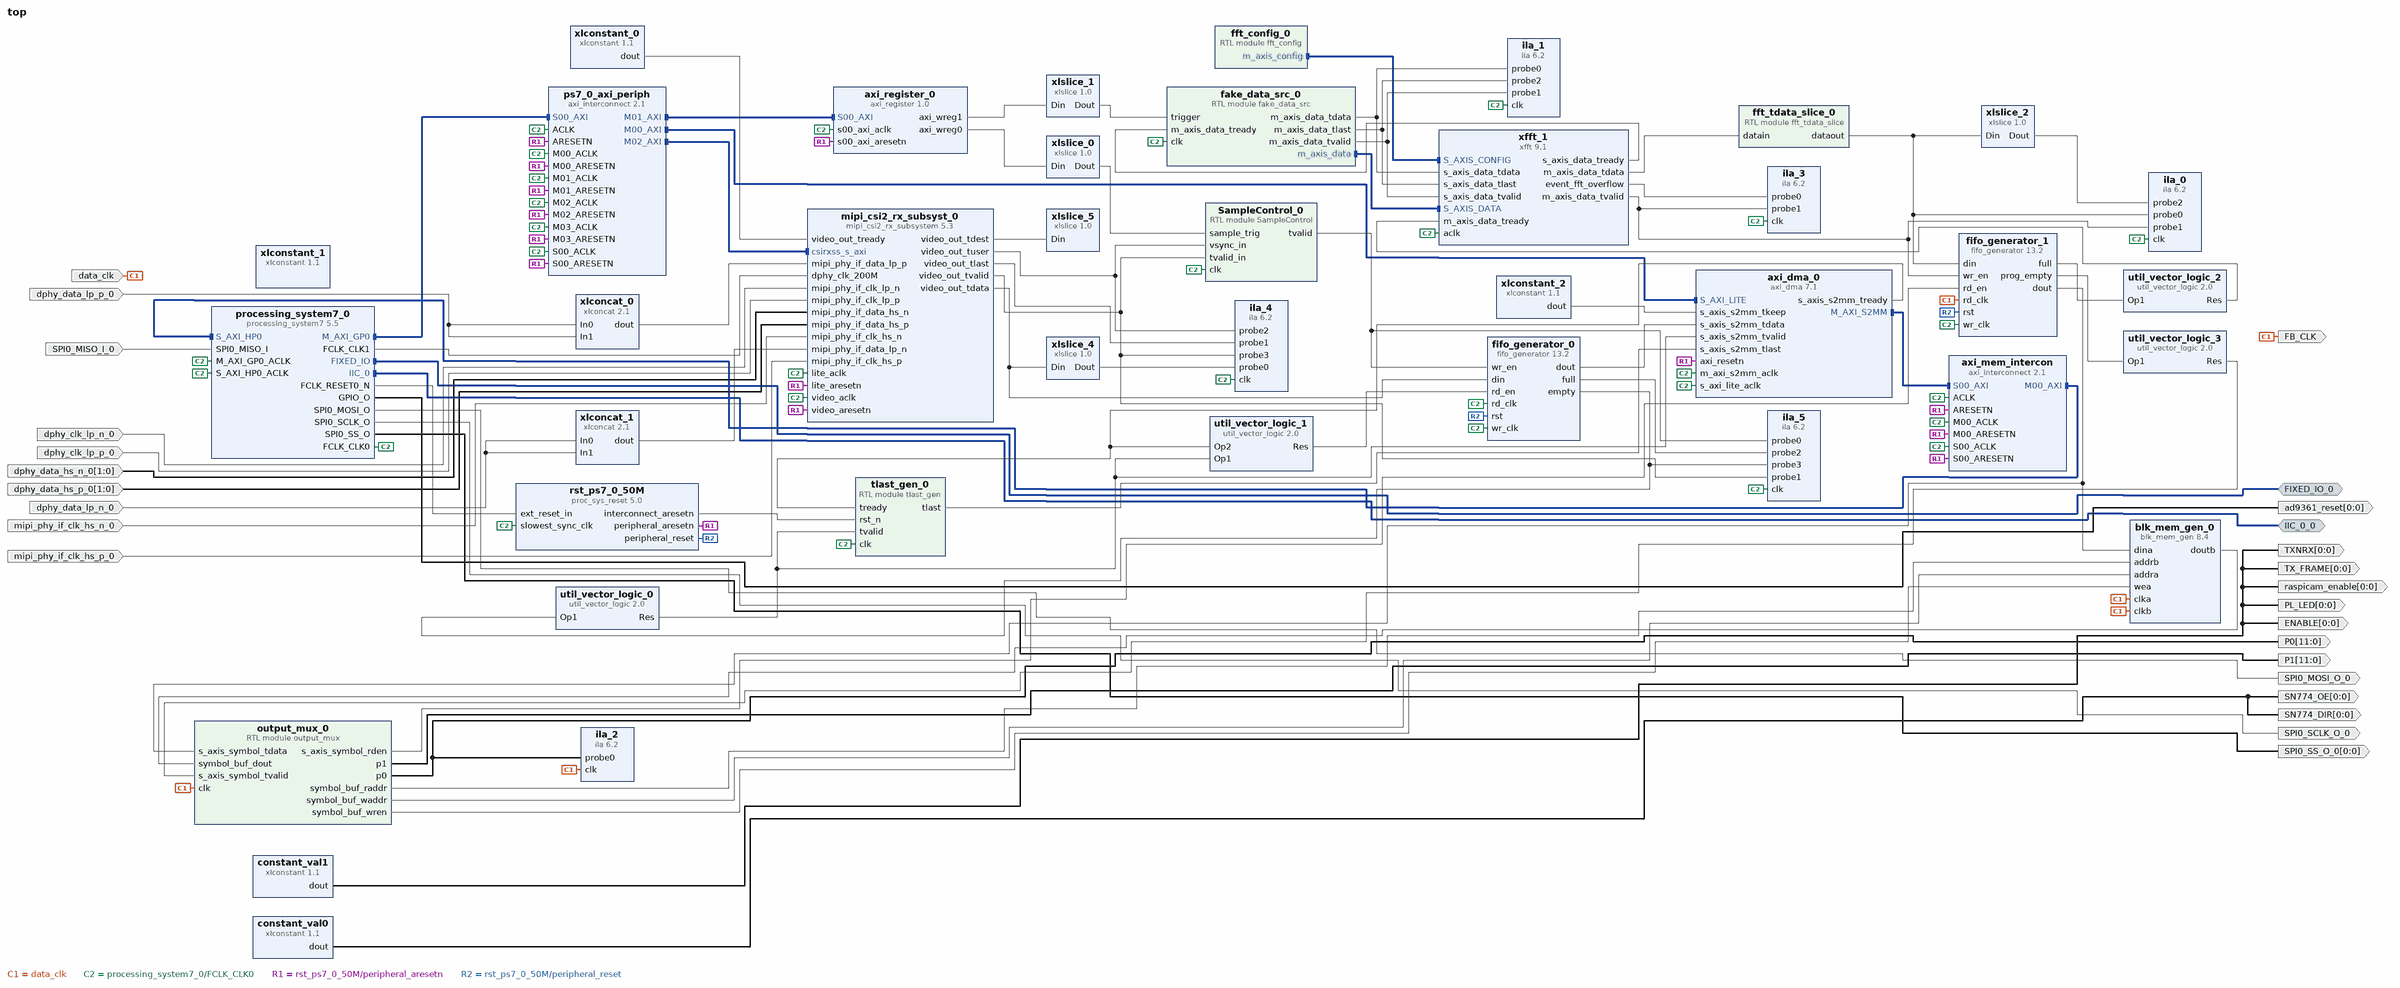
[diagram p0: block diagram of the top level]
# Vivado block design top, xc7z010clg400-2, Vivado 2023.1
create_bd_design top

create_bd_intf_port -mode Master -vlnv xilinx.com:display_processing_system7:fixedio_rtl:1.0 FIXED_IO_0
create_bd_intf_port -mode Master -vlnv xilinx.com:interface:iic_rtl:1.0 IIC_0_0
create_bd_port -dir O -from 0 -to 0 ENABLE
create_bd_port -dir O -type clk FB_CLK
create_bd_port -dir O -from 11 -to 0 -type data P0
create_bd_port -dir O -from 11 -to 0 -type data P1
create_bd_port -dir I SPI0_MISO_I_0
create_bd_port -dir O SPI0_MOSI_O_0
create_bd_port -dir O SPI0_SCLK_O_0
create_bd_port -dir O -from 0 -to 0 SPI0_SS_O_0
create_bd_port -dir O -from 0 -to 0 TXNRX
create_bd_port -dir O -from 0 -to 0 -type data TX_FRAME
create_bd_port -dir O -from 0 -to 0 ad9361_reset
create_bd_port -dir I data_clk
create_bd_port -dir I dphy_clk_lp_p_0
create_bd_port -dir I dphy_clk_lp_n_0
create_bd_port -dir I -from 1 -to 0 dphy_data_hs_p_0
create_bd_port -dir I -from 1 -to 0 dphy_data_hs_n_0
create_bd_port -dir I dphy_data_lp_p_0
create_bd_port -dir I dphy_data_lp_n_0
create_bd_port -dir O -from 0 -to 0 PL_LED
create_bd_port -dir O -from 0 -to 0 raspicam_enable
create_bd_port -dir O -from 0 -to 0 SN774_OE
create_bd_port -dir O -from 0 -to 0 SN774_DIR
create_bd_port -dir I mipi_phy_if_clk_hs_n_0
create_bd_port -dir I mipi_phy_if_clk_hs_p_0

create_bd_cell -type ip -vlnv xilinx.com:ip:axi_dma:7.1 axi_dma_0
set_property -dict [list \
  CONFIG.c_include_mm2s 0 \
  CONFIG.c_include_s2mm 1 \
  CONFIG.c_include_s2mm_dre 1 \
  CONFIG.c_include_sg 0 \
  CONFIG.c_s2mm_burst_size 64 \
  CONFIG.c_sg_length_width 26 \
] [get_bd_cells axi_dma_0]
create_bd_cell -type ip -vlnv xilinx.com:ip:axi_interconnect:2.1 axi_mem_intercon
set_property -dict {CONFIG.NUM_MI 1} [get_bd_cells axi_mem_intercon]
create_bd_cell -type ip -vlnv xilinx.com:user:axi_register:1.0 axi_register_0
create_bd_cell -type ip -vlnv xilinx.com:ip:blk_mem_gen:8.4 blk_mem_gen_0
set_property -dict [list \
  CONFIG.Assume_Synchronous_Clk true \
  CONFIG.Enable_32bit_Address false \
  CONFIG.Enable_A Always_Enabled \
  CONFIG.Enable_B Always_Enabled \
  CONFIG.Fill_Remaining_Memory_Locations true \
  CONFIG.Memory_Type Simple_Dual_Port_RAM \
  CONFIG.Operating_Mode_A NO_CHANGE \
  CONFIG.Port_B_Clock 100 \
  CONFIG.Port_B_Enable_Rate 100 \
  CONFIG.Read_Width_B 24 \
  CONFIG.Register_PortB_Output_of_Memory_Primitives false \
  CONFIG.Use_Byte_Write_Enable false \
  CONFIG.Write_Depth_A 2048 \
  CONFIG.Write_Width_A 24 \
  CONFIG.Write_Width_B 24 \
  CONFIG.use_bram_block Stand_Alone \
] [get_bd_cells blk_mem_gen_0]
create_bd_cell -type module -reference fake_data_src fake_data_src_0
create_bd_cell -type module -reference fft_config fft_config_0
create_bd_cell -type module -reference fft_tdata_slice fft_tdata_slice_0
create_bd_cell -type ip -vlnv xilinx.com:ip:fifo_generator:13.2 fifo_generator_0
set_property -dict [list \
  CONFIG.Fifo_Implementation Independent_Clocks_Builtin_FIFO \
  CONFIG.Input_Data_Width 32 \
  CONFIG.Input_Depth 1024 \
  CONFIG.Performance_Options First_Word_Fall_Through \
  CONFIG.Read_Clock_Frequency 100 \
  CONFIG.Write_Clock_Frequency 61 \
] [get_bd_cells fifo_generator_0]
create_bd_cell -type ip -vlnv xilinx.com:ip:fifo_generator:13.2 fifo_generator_1
set_property -dict [list \
  CONFIG.Empty_Threshold_Assert_Value 128 \
  CONFIG.Fifo_Implementation Independent_Clocks_Builtin_FIFO \
  CONFIG.INTERFACE_TYPE Native \
  CONFIG.Input_Data_Width 24 \
  CONFIG.Input_Depth 8192 \
  CONFIG.Performance_Options First_Word_Fall_Through \
  CONFIG.Programmable_Empty_Type Single_Programmable_Empty_Threshold_Constant \
  CONFIG.Read_Clock_Frequency 61 \
  CONFIG.Write_Clock_Frequency 150 \
  CONFIG.axis_type FIFO \
] [get_bd_cells fifo_generator_1]
create_bd_cell -type ip -vlnv xilinx.com:ip:ila:6.2 ila_0
set_property -dict [list \
  CONFIG.C_DATA_DEPTH 4096 \
  CONFIG.C_ENABLE_ILA_AXI_MON false \
  CONFIG.C_MONITOR_TYPE Native \
  CONFIG.C_NUM_OF_PROBES 3 \
  CONFIG.C_PROBE0_WIDTH 12 \
  CONFIG.C_PROBE2_WIDTH 12 \
] [get_bd_cells ila_0]
create_bd_cell -type ip -vlnv xilinx.com:ip:ila:6.2 ila_1
set_property -dict [list \
  CONFIG.C_DATA_DEPTH 4096 \
  CONFIG.C_ENABLE_ILA_AXI_MON false \
  CONFIG.C_MONITOR_TYPE Native \
  CONFIG.C_NUM_OF_PROBES 3 \
  CONFIG.C_PROBE0_WIDTH 12 \
] [get_bd_cells ila_1]
create_bd_cell -type ip -vlnv xilinx.com:ip:ila:6.2 ila_2
set_property -dict [list \
  CONFIG.C_DATA_DEPTH 8192 \
  CONFIG.C_ENABLE_ILA_AXI_MON false \
  CONFIG.C_MONITOR_TYPE Native \
  CONFIG.C_NUM_OF_PROBES 1 \
  CONFIG.C_PROBE0_WIDTH 12 \
] [get_bd_cells ila_2]
create_bd_cell -type ip -vlnv xilinx.com:ip:ila:6.2 ila_3
set_property -dict {CONFIG.C_ENABLE_ILA_AXI_MON false CONFIG.C_MONITOR_TYPE Native CONFIG.C_NUM_OF_PROBES 2} [get_bd_cells ila_3]
create_bd_cell -type ip -vlnv xilinx.com:ip:ila:6.2 ila_4
set_property -dict [list \
  CONFIG.C_DATA_DEPTH 8192 \
  CONFIG.C_MONITOR_TYPE Native \
  CONFIG.C_NUM_OF_PROBES 4 \
  CONFIG.C_PROBE0_WIDTH 10 \
  CONFIG.C_PROBE1_WIDTH 1 \
  CONFIG.C_PROBE2_WIDTH 1 \
  CONFIG.C_PROBE4_WIDTH 1 \
  CONFIG.C_SLOT_0_AXI_PROTOCOL AXI4S \
] [get_bd_cells ila_4]
create_bd_cell -type ip -vlnv xilinx.com:ip:mipi_csi2_rx_subsystem:5.3 mipi_csi2_rx_subsyst_0
set_property -dict [list \
  CONFIG.AXIS_TDATA_WIDTH 32 \
  CONFIG.AXIS_TUSER_WIDTH 1 \
  CONFIG.CMN_INC_VFB false \
  CONFIG.CMN_NUM_LANES 2 \
  CONFIG.CMN_PXL_FORMAT RAW10 \
  CONFIG.CSI_BUF_DEPTH 2048 \
  CONFIG.C_CSI_EN_ACTIVELANES false \
  CONFIG.C_CSI_FILTER_USERDATATYPE true \
  CONFIG.C_DPHY_LANES 2 \
  CONFIG.C_EN_7S_LINERATE_CHECK true \
  CONFIG.C_EN_TIMEOUT_REGS false \
  CONFIG.C_HS_SETTLE_NS 146 \
  CONFIG.DPY_EN_REG_IF true \
  CONFIG.DPY_LINE_RATE 900 \
] [get_bd_cells mipi_csi2_rx_subsyst_0]
create_bd_cell -type ip -vlnv xilinx.com:ip:processing_system7:5.5 processing_system7_0
set_property -dict [list \
  CONFIG.PCW_APU_CLK_RATIO_ENABLE 4:2:1 \
  CONFIG.PCW_APU_PERIPHERAL_FREQMHZ 200 \
  CONFIG.PCW_CPU_CPU_6X4X_MAX_RANGE 600 \
  CONFIG.PCW_CPU_PERIPHERAL_CLKSRC {DDR PLL} \
  CONFIG.PCW_CRYSTAL_PERIPHERAL_FREQMHZ 33.33333 \
  CONFIG.PCW_ENET0_PERIPHERAL_ENABLE 0 \
  CONFIG.PCW_EN_CLK1_PORT 1 \
  CONFIG.PCW_EN_CLK2_PORT 1 \
  CONFIG.PCW_FCLK_CLK2_BUF TRUE \
  CONFIG.PCW_FPGA0_PERIPHERAL_FREQMHZ 80 \
  CONFIG.PCW_FPGA1_PERIPHERAL_FREQMHZ 200 \
  CONFIG.PCW_FPGA2_PERIPHERAL_FREQMHZ 150 \
  CONFIG.PCW_FPGA_FCLK1_ENABLE 1 \
  CONFIG.PCW_FPGA_FCLK2_ENABLE 1 \
  CONFIG.PCW_GPIO_EMIO_GPIO_ENABLE 1 \
  CONFIG.PCW_GPIO_EMIO_GPIO_IO 1 \
  CONFIG.PCW_GPIO_EMIO_GPIO_WIDTH 1 \
  CONFIG.PCW_GPIO_MIO_GPIO_ENABLE 1 \
  CONFIG.PCW_GPIO_MIO_GPIO_IO MIO \
  CONFIG.PCW_I2C0_I2C0_IO EMIO \
  CONFIG.PCW_I2C0_PERIPHERAL_ENABLE 1 \
  CONFIG.PCW_I2C_PERIPHERAL_FREQMHZ 49.999996 \
  CONFIG.PCW_I2C_RESET_ENABLE 1 \
  CONFIG.PCW_I2C_RESET_SELECT {Share reset pin} \
  CONFIG.PCW_PERIPHERAL_BOARD_PRESET None \
  CONFIG.PCW_PRESET_BANK1_VOLTAGE {LVCMOS 3.3V} \
  CONFIG.PCW_QSPI_PERIPHERAL_ENABLE 0 \
  CONFIG.PCW_SD0_GRP_CD_ENABLE 0 \
  CONFIG.PCW_SD0_GRP_WP_ENABLE 0 \
  CONFIG.PCW_SD0_PERIPHERAL_ENABLE 1 \
  CONFIG.PCW_SD0_SD0_IO {MIO 40 .. 45} \
  CONFIG.PCW_SDIO_PERIPHERAL_FREQMHZ 50 \
  CONFIG.PCW_SPI0_PERIPHERAL_ENABLE 1 \
  CONFIG.PCW_SPI0_SPI0_IO EMIO \
  CONFIG.PCW_SPI_PERIPHERAL_FREQMHZ 100 \
  CONFIG.PCW_UART1_BAUD_RATE 921600 \
  CONFIG.PCW_UART1_PERIPHERAL_ENABLE 1 \
  CONFIG.PCW_UART1_UART1_IO {MIO 36 .. 37} \
  CONFIG.PCW_UART_PERIPHERAL_FREQMHZ 100 \
  CONFIG.PCW_UIPARAM_DDR_BUS_WIDTH {16 Bit} \
  CONFIG.PCW_UIPARAM_DDR_FREQ_MHZ 400 \
  CONFIG.PCW_UIPARAM_DDR_MEMORY_TYPE {DDR 3 (Low Voltage)} \
  CONFIG.PCW_UIPARAM_DDR_PARTNO {MT41K256M16 RE-125} \
  CONFIG.PCW_UIPARAM_GENERATE_SUMMARY NONE \
  CONFIG.PCW_USB0_PERIPHERAL_ENABLE 0 \
  CONFIG.PCW_USB_RESET_ENABLE 1 \
  CONFIG.PCW_USE_AXI_NONSECURE 1 \
  CONFIG.PCW_USE_S_AXI_HP0 1 \
] [get_bd_cells processing_system7_0]
# 490 more settings of processing_system7_0 are not shown: defaults, MIO pin electricals, DDR timing, and values the tool derives
create_bd_cell -type ip -vlnv xilinx.com:ip:axi_interconnect:2.1 ps7_0_axi_periph
set_property -dict {CONFIG.NUM_MI 4} [get_bd_cells ps7_0_axi_periph]
create_bd_cell -type ip -vlnv xilinx.com:ip:proc_sys_reset:5.0 rst_ps7_0_50M
create_bd_cell -type ip -vlnv xilinx.com:ip:util_vector_logic:2.0 util_vector_logic_0
set_property -dict {CONFIG.C_OPERATION not CONFIG.C_SIZE 1} [get_bd_cells util_vector_logic_0]
create_bd_cell -type ip -vlnv xilinx.com:ip:util_vector_logic:2.0 util_vector_logic_1
set_property -dict {CONFIG.C_SIZE 1} [get_bd_cells util_vector_logic_1]
create_bd_cell -type ip -vlnv xilinx.com:ip:util_vector_logic:2.0 util_vector_logic_2
set_property -dict {CONFIG.C_OPERATION not CONFIG.C_SIZE 1} [get_bd_cells util_vector_logic_2]
create_bd_cell -type ip -vlnv xilinx.com:ip:util_vector_logic:2.0 util_vector_logic_3
set_property -dict {CONFIG.C_OPERATION not CONFIG.C_SIZE 1} [get_bd_cells util_vector_logic_3]
create_bd_cell -type ip -vlnv xilinx.com:ip:xfft:9.1 xfft_1
set_property -dict [list \
  CONFIG.cyclic_prefix_insertion true \
  CONFIG.implementation_options pipelined_streaming_io \
  CONFIG.input_width 12 \
  CONFIG.number_of_stages_using_block_ram_for_data_and_phase_factors 3 \
  CONFIG.output_ordering natural_order \
  CONFIG.ovflo true \
  CONFIG.target_clock_frequency 100 \
] [get_bd_cells xfft_1]
create_bd_cell -type ip -vlnv xilinx.com:ip:xlconcat:2.1 xlconcat_0
create_bd_cell -type ip -vlnv xilinx.com:ip:xlconcat:2.1 xlconcat_1
create_bd_cell -type ip -vlnv xilinx.com:ip:xlconstant:1.1 constant_val1
create_bd_cell -type ip -vlnv xilinx.com:ip:xlconstant:1.1 xlconstant_0
create_bd_cell -type ip -vlnv xilinx.com:ip:xlconstant:1.1 xlconstant_1
set_property -dict {CONFIG.CONST_VAL 0 CONFIG.CONST_WIDTH 4} [get_bd_cells xlconstant_1]
create_bd_cell -type ip -vlnv xilinx.com:ip:xlconstant:1.1 xlconstant_2
set_property -dict {CONFIG.CONST_VAL 0xf CONFIG.CONST_WIDTH 4} [get_bd_cells xlconstant_2]
create_bd_cell -type ip -vlnv xilinx.com:ip:xlconstant:1.1 constant_val0
set_property -dict {CONFIG.CONST_VAL 0} [get_bd_cells constant_val0]
create_bd_cell -type ip -vlnv xilinx.com:ip:xlslice:1.0 xlslice_0
set_property -dict {CONFIG.DIN_FROM 31 CONFIG.DIN_TO 31} [get_bd_cells xlslice_0]
create_bd_cell -type ip -vlnv xilinx.com:ip:xlslice:1.0 xlslice_1
set_property -dict {CONFIG.DIN_FROM 31 CONFIG.DIN_TO 31} [get_bd_cells xlslice_1]
create_bd_cell -type ip -vlnv xilinx.com:ip:xlslice:1.0 xlslice_2
set_property -dict {CONFIG.DIN_FROM 23 CONFIG.DIN_TO 12 CONFIG.DIN_WIDTH 24 CONFIG.DOUT_WIDTH 12} [get_bd_cells xlslice_2]
create_bd_cell -type ip -vlnv xilinx.com:ip:xlslice:1.0 xlslice_4
set_property -dict {CONFIG.DIN_FROM 9 CONFIG.DIN_TO 0 CONFIG.DIN_WIDTH 24 CONFIG.DOUT_WIDTH 10} [get_bd_cells xlslice_4]
create_bd_cell -type ip -vlnv xilinx.com:ip:xlslice:1.0 xlslice_5
set_property -dict {CONFIG.DIN_WIDTH 10} [get_bd_cells xlslice_5]
create_bd_cell -type module -reference tlast_gen tlast_gen_0
set_property -dict {CONFIG.PKT_LENGTH 663552} [get_bd_cells tlast_gen_0]
create_bd_cell -type module -reference output_mux output_mux_0
create_bd_cell -type ip -vlnv xilinx.com:ip:ila:6.2 ila_5
set_property -dict {CONFIG.C_DATA_DEPTH 4096 CONFIG.C_MONITOR_TYPE Native CONFIG.C_NUM_OF_PROBES 4} [get_bd_cells ila_5]
create_bd_cell -type module -reference SampleControl SampleControl_0
set_property -dict {CONFIG.PKT_LENGTH 663552} [get_bd_cells SampleControl_0]

# ---- connections ----

connect_bd_intf_net [get_bd_intf_pins axi_dma_0/M_AXI_S2MM] [get_bd_intf_pins axi_mem_intercon/S00_AXI]
connect_bd_intf_net [get_bd_intf_pins axi_mem_intercon/M00_AXI] [get_bd_intf_pins processing_system7_0/S_AXI_HP0]
connect_bd_intf_net [get_bd_intf_pins fake_data_src_0/m_axis_data] [get_bd_intf_pins xfft_1/S_AXIS_DATA]
connect_bd_intf_net [get_bd_intf_pins fft_config_0/m_axis_config] [get_bd_intf_pins xfft_1/S_AXIS_CONFIG]
connect_bd_intf_net [get_bd_intf_ports FIXED_IO_0] [get_bd_intf_pins processing_system7_0/FIXED_IO]
connect_bd_intf_net [get_bd_intf_ports IIC_0_0] [get_bd_intf_pins processing_system7_0/IIC_0]
connect_bd_intf_net [get_bd_intf_pins processing_system7_0/M_AXI_GP0] [get_bd_intf_pins ps7_0_axi_periph/S00_AXI]
connect_bd_intf_net [get_bd_intf_pins ps7_0_axi_periph/M00_AXI] [get_bd_intf_pins axi_dma_0/S_AXI_LITE]
connect_bd_intf_net [get_bd_intf_pins ps7_0_axi_periph/M01_AXI] [get_bd_intf_pins axi_register_0/S00_AXI]
connect_bd_intf_net [get_bd_intf_pins ps7_0_axi_periph/M02_AXI] [get_bd_intf_pins mipi_csi2_rx_subsyst_0/csirxss_s_axi]
connect_bd_net -net SPI0_MISO_I_0_1 [get_bd_ports SPI0_MISO_I_0] [get_bd_pins processing_system7_0/SPI0_MISO_I]
connect_bd_net [get_bd_pins SampleControl_0/tvalid] [get_bd_pins fifo_generator_0/wr_en] [get_bd_pins ila_5/probe0]
connect_bd_net [get_bd_pins axi_dma_0/s_axis_s2mm_tready] [get_bd_pins util_vector_logic_1/Op2] [get_bd_pins tlast_gen_0/tready]
connect_bd_net [get_bd_pins axi_register_0/axi_wreg0] [get_bd_pins xlslice_0/Din]
connect_bd_net [get_bd_pins axi_register_0/axi_wreg1] [get_bd_pins xlslice_1/Din]
connect_bd_net -net axis_data_fifo_0_m_axis_tdata [get_bd_pins fifo_generator_1/dout] \
  [get_bd_pins blk_mem_gen_0/dina] [get_bd_pins output_mux_0/s_axis_symbol_tdata]
connect_bd_net [get_bd_pins blk_mem_gen_0/doutb] [get_bd_pins output_mux_0/symbol_buf_dout]
connect_bd_net [get_bd_ports data_clk] \
  [get_bd_ports FB_CLK] [get_bd_pins blk_mem_gen_0/clka] [get_bd_pins blk_mem_gen_0/clkb] \
  [get_bd_pins fifo_generator_1/rd_clk] [get_bd_pins ila_2/clk] [get_bd_pins output_mux_0/clk]
connect_bd_net -net dphy_clk_lp_n_0_1 [get_bd_ports dphy_clk_lp_n_0] [get_bd_pins mipi_csi2_rx_subsyst_0/mipi_phy_if_clk_lp_n]
connect_bd_net -net dphy_clk_lp_p_0_1 [get_bd_ports dphy_clk_lp_p_0] [get_bd_pins mipi_csi2_rx_subsyst_0/mipi_phy_if_clk_lp_p]
connect_bd_net -net dphy_data_hs_n_0_1 [get_bd_ports dphy_data_hs_n_0] [get_bd_pins mipi_csi2_rx_subsyst_0/mipi_phy_if_data_hs_n]
connect_bd_net -net dphy_data_hs_p_0_1 [get_bd_ports dphy_data_hs_p_0] [get_bd_pins mipi_csi2_rx_subsyst_0/mipi_phy_if_data_hs_p]
connect_bd_net -net dphy_data_lp_n_0_1 [get_bd_ports dphy_data_lp_n_0] [get_bd_pins xlconcat_1/In0] [get_bd_pins xlconcat_1/In1]
connect_bd_net -net dphy_data_lp_p_0_1 [get_bd_ports dphy_data_lp_p_0] [get_bd_pins xlconcat_0/In0] [get_bd_pins xlconcat_0/In1]
connect_bd_net [get_bd_pins fake_data_src_0/m_axis_data_tdata] [get_bd_pins ila_1/probe0] [get_bd_pins xfft_1/s_axis_data_tdata]
connect_bd_net [get_bd_pins fake_data_src_0/m_axis_data_tlast] [get_bd_pins ila_1/probe2] [get_bd_pins xfft_1/s_axis_data_tlast]
connect_bd_net [get_bd_pins fake_data_src_0/m_axis_data_tvalid] [get_bd_pins ila_1/probe1] [get_bd_pins xfft_1/s_axis_data_tvalid]
connect_bd_net [get_bd_pins fft_tdata_slice_0/dataout] [get_bd_pins fifo_generator_1/din] [get_bd_pins ila_0/probe0] [get_bd_pins xlslice_2/Din]
connect_bd_net [get_bd_pins fifo_generator_0/dout] [get_bd_pins axi_dma_0/s_axis_s2mm_tdata]
connect_bd_net [get_bd_pins fifo_generator_0/empty] [get_bd_pins util_vector_logic_0/Op1] [get_bd_pins ila_5/probe3]
connect_bd_net [get_bd_pins fifo_generator_0/full] [get_bd_pins ila_5/probe2]
connect_bd_net [get_bd_pins fifo_generator_1/full] [get_bd_pins util_vector_logic_2/Op1]
connect_bd_net [get_bd_pins fifo_generator_1/prog_empty] [get_bd_pins util_vector_logic_3/Op1]
connect_bd_net [get_bd_pins mipi_csi2_rx_subsyst_0/video_out_tdata] [get_bd_pins xlslice_4/Din] [get_bd_pins fifo_generator_0/din]
connect_bd_net [get_bd_pins mipi_csi2_rx_subsyst_0/video_out_tdest] [get_bd_pins xlslice_5/Din]
connect_bd_net [get_bd_pins mipi_csi2_rx_subsyst_0/video_out_tlast] [get_bd_pins ila_4/probe1]
connect_bd_net [get_bd_pins mipi_csi2_rx_subsyst_0/video_out_tuser] [get_bd_pins SampleControl_0/vsync_in] [get_bd_pins ila_4/probe2]
connect_bd_net [get_bd_pins mipi_csi2_rx_subsyst_0/video_out_tvalid] \
  [get_bd_pins ila_4/probe3] [get_bd_pins ila_5/probe1] [get_bd_pins SampleControl_0/tvalid_in]
connect_bd_net -net mipi_phy_if_clk_hs_n_0_1 [get_bd_ports mipi_phy_if_clk_hs_n_0] [get_bd_pins mipi_csi2_rx_subsyst_0/mipi_phy_if_clk_hs_n]
connect_bd_net -net mipi_phy_if_clk_hs_p_0_1 [get_bd_ports mipi_phy_if_clk_hs_p_0] [get_bd_pins mipi_csi2_rx_subsyst_0/mipi_phy_if_clk_hs_p]
connect_bd_net [get_bd_pins output_mux_0/p0] [get_bd_ports P0] [get_bd_pins ila_2/probe0]
connect_bd_net [get_bd_pins output_mux_0/p1] [get_bd_ports P1]
connect_bd_net -net output_mux_0_s_axis_symbol_tready [get_bd_pins output_mux_0/s_axis_symbol_rden] [get_bd_pins fifo_generator_1/rd_en]
connect_bd_net [get_bd_pins output_mux_0/symbol_buf_raddr] [get_bd_pins blk_mem_gen_0/addrb]
connect_bd_net [get_bd_pins output_mux_0/symbol_buf_waddr] [get_bd_pins blk_mem_gen_0/addra]
connect_bd_net [get_bd_pins output_mux_0/symbol_buf_wren] [get_bd_pins blk_mem_gen_0/wea]
connect_bd_net [get_bd_pins processing_system7_0/FCLK_CLK0] \
  [get_bd_pins axi_dma_0/s_axi_lite_aclk] [get_bd_pins axi_dma_0/m_axi_s2mm_aclk] [get_bd_pins axi_mem_intercon/ACLK] \
  [get_bd_pins axi_mem_intercon/S00_ACLK] [get_bd_pins axi_mem_intercon/M00_ACLK] [get_bd_pins axi_register_0/s00_axi_aclk] \
  [get_bd_pins fake_data_src_0/clk] [get_bd_pins fifo_generator_0/rd_clk] [get_bd_pins fifo_generator_1/wr_clk] \
  [get_bd_pins ila_0/clk] [get_bd_pins ila_1/clk] [get_bd_pins ila_3/clk] [get_bd_pins ila_4/clk] \
  [get_bd_pins mipi_csi2_rx_subsyst_0/lite_aclk] [get_bd_pins mipi_csi2_rx_subsyst_0/video_aclk] \
  [get_bd_pins processing_system7_0/M_AXI_GP0_ACLK] [get_bd_pins processing_system7_0/S_AXI_HP0_ACLK] \
  [get_bd_pins ps7_0_axi_periph/ACLK] [get_bd_pins ps7_0_axi_periph/S00_ACLK] [get_bd_pins ps7_0_axi_periph/M00_ACLK] \
  [get_bd_pins ps7_0_axi_periph/M01_ACLK] [get_bd_pins ps7_0_axi_periph/M02_ACLK] [get_bd_pins ps7_0_axi_periph/M03_ACLK] \
  [get_bd_pins rst_ps7_0_50M/slowest_sync_clk] [get_bd_pins xfft_1/aclk] [get_bd_pins fifo_generator_0/wr_clk] \
  [get_bd_pins tlast_gen_0/clk] [get_bd_pins ila_5/clk] [get_bd_pins SampleControl_0/clk]
connect_bd_net [get_bd_pins processing_system7_0/FCLK_CLK1] [get_bd_pins mipi_csi2_rx_subsyst_0/dphy_clk_200M]
connect_bd_net [get_bd_pins processing_system7_0/FCLK_RESET0_N] [get_bd_pins rst_ps7_0_50M/ext_reset_in]
connect_bd_net [get_bd_pins processing_system7_0/GPIO_O] [get_bd_ports ad9361_reset]
connect_bd_net [get_bd_pins processing_system7_0/SPI0_MOSI_O] [get_bd_ports SPI0_MOSI_O_0]
connect_bd_net [get_bd_pins processing_system7_0/SPI0_SCLK_O] [get_bd_ports SPI0_SCLK_O_0]
connect_bd_net [get_bd_pins processing_system7_0/SPI0_SS_O] [get_bd_ports SPI0_SS_O_0]
connect_bd_net [get_bd_pins rst_ps7_0_50M/interconnect_aresetn] [get_bd_pins tlast_gen_0/rst_n]
connect_bd_net [get_bd_pins rst_ps7_0_50M/peripheral_aresetn] \
  [get_bd_pins axi_dma_0/axi_resetn] [get_bd_pins axi_mem_intercon/ARESETN] [get_bd_pins axi_mem_intercon/S00_ARESETN] \
  [get_bd_pins axi_mem_intercon/M00_ARESETN] [get_bd_pins axi_register_0/s00_axi_aresetn] \
  [get_bd_pins mipi_csi2_rx_subsyst_0/lite_aresetn] [get_bd_pins mipi_csi2_rx_subsyst_0/video_aresetn] \
  [get_bd_pins ps7_0_axi_periph/ARESETN] [get_bd_pins ps7_0_axi_periph/S00_ARESETN] \
  [get_bd_pins ps7_0_axi_periph/M00_ARESETN] [get_bd_pins ps7_0_axi_periph/M01_ARESETN] \
  [get_bd_pins ps7_0_axi_periph/M02_ARESETN] [get_bd_pins ps7_0_axi_periph/M03_ARESETN]
connect_bd_net [get_bd_pins rst_ps7_0_50M/peripheral_reset] [get_bd_pins fifo_generator_1/rst] [get_bd_pins fifo_generator_0/rst]
connect_bd_net [get_bd_pins tlast_gen_0/tlast] [get_bd_pins axi_dma_0/s_axis_s2mm_tlast]
connect_bd_net [get_bd_pins util_vector_logic_0/Res] \
  [get_bd_pins axi_dma_0/s_axis_s2mm_tvalid] [get_bd_pins util_vector_logic_1/Op1] [get_bd_pins tlast_gen_0/tvalid]
connect_bd_net [get_bd_pins util_vector_logic_1/Res] [get_bd_pins fifo_generator_0/rd_en]
connect_bd_net [get_bd_pins util_vector_logic_2/Res] [get_bd_pins xfft_1/m_axis_data_tready]
connect_bd_net [get_bd_pins util_vector_logic_3/Res] [get_bd_pins output_mux_0/s_axis_symbol_tvalid]
connect_bd_net [get_bd_pins xfft_1/event_fft_overflow] [get_bd_pins ila_3/probe0]
connect_bd_net [get_bd_pins xfft_1/m_axis_data_tdata] [get_bd_pins fft_tdata_slice_0/datain]
connect_bd_net [get_bd_pins xfft_1/m_axis_data_tvalid] [get_bd_pins fifo_generator_1/wr_en] [get_bd_pins ila_0/probe1] [get_bd_pins ila_3/probe1]
connect_bd_net [get_bd_pins xfft_1/s_axis_data_tready] [get_bd_pins fake_data_src_0/m_axis_data_tready]
connect_bd_net [get_bd_pins xlconcat_0/dout] [get_bd_pins mipi_csi2_rx_subsyst_0/mipi_phy_if_data_lp_p]
connect_bd_net [get_bd_pins xlconcat_1/dout] [get_bd_pins mipi_csi2_rx_subsyst_0/mipi_phy_if_data_lp_n]
connect_bd_net -net xlconstant_0_dout [get_bd_pins constant_val1/dout] \
  [get_bd_ports ENABLE] [get_bd_ports PL_LED] [get_bd_ports raspicam_enable] [get_bd_ports TXNRX] [get_bd_ports TX_FRAME]
connect_bd_net [get_bd_pins xlconstant_0/dout] [get_bd_pins mipi_csi2_rx_subsyst_0/video_out_tready]
connect_bd_net [get_bd_pins xlconstant_2/dout] [get_bd_pins axi_dma_0/s_axis_s2mm_tkeep]
connect_bd_net -net xlconstant_3_dout [get_bd_pins constant_val0/dout] [get_bd_ports SN774_OE] [get_bd_ports SN774_DIR]
connect_bd_net [get_bd_pins xlslice_0/Dout] [get_bd_pins SampleControl_0/sample_trig]
connect_bd_net [get_bd_pins xlslice_1/Dout] [get_bd_pins fake_data_src_0/trigger]
connect_bd_net [get_bd_pins xlslice_2/Dout] [get_bd_pins ila_0/probe2]
connect_bd_net [get_bd_pins xlslice_4/Dout] [get_bd_pins ila_4/probe0]

# ---- address map ----
assign_bd_address -offset 0x00000000 -range 512M -target_address_space [get_bd_addr_spaces axi_dma_0/Data_S2MM] [get_bd_addr_segs processing_system7_0/S_AXI_HP0/HP0_DDR_LOWOCM]
assign_bd_address -offset 0x40400000 -range 64K -target_address_space [get_bd_addr_spaces processing_system7_0/Data] [get_bd_addr_segs axi_dma_0/S_AXI_LITE/Reg]
assign_bd_address -offset 0x43C00000 -range 64K -target_address_space [get_bd_addr_spaces processing_system7_0/Data] [get_bd_addr_segs axi_register_0/S00_AXI/S00_AXI_reg]
assign_bd_address -offset 0x43C10000 -range 8K -target_address_space [get_bd_addr_spaces processing_system7_0/Data] [get_bd_addr_segs mipi_csi2_rx_subsyst_0/csirxss_s_axi/Reg]

validate_bd_design
save_bd_design
